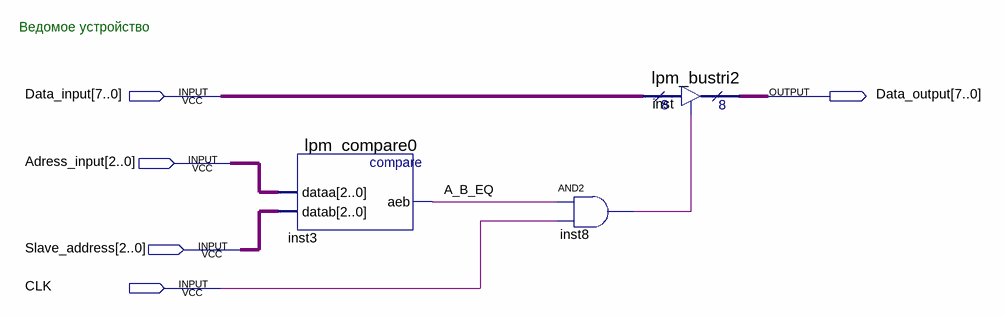
[diagram p0: schematic sheet]
// Quartus schematic Block6.bdf as structural Verilog: 3 symbols, 5 pins
module Block6 (
  input  [7:0] Data_input,
  input  [2:0] Adress_input,
  input  [2:0] Slave_address,
  input  CLK,
  output [7:0] Data_output
);

  wire A_B_EQ, inst8_out;

  lpm_compare0 inst3 (.dataa(Adress_input), .datab(Slave_address), .aeb(A_B_EQ));
  and inst8 (inst8_out, A_B_EQ, CLK);
  lpm_bustri2 inst (.enabledt(inst8_out), .data(Data_input), .tridata(Data_output));

  // Notes on the sheet:
  //   Ведомое устройство
endmodule
